# Altium schematic sheet 遥控启停.SchDoc
size A4; SheetNumber: 1; SheetTotal: 1
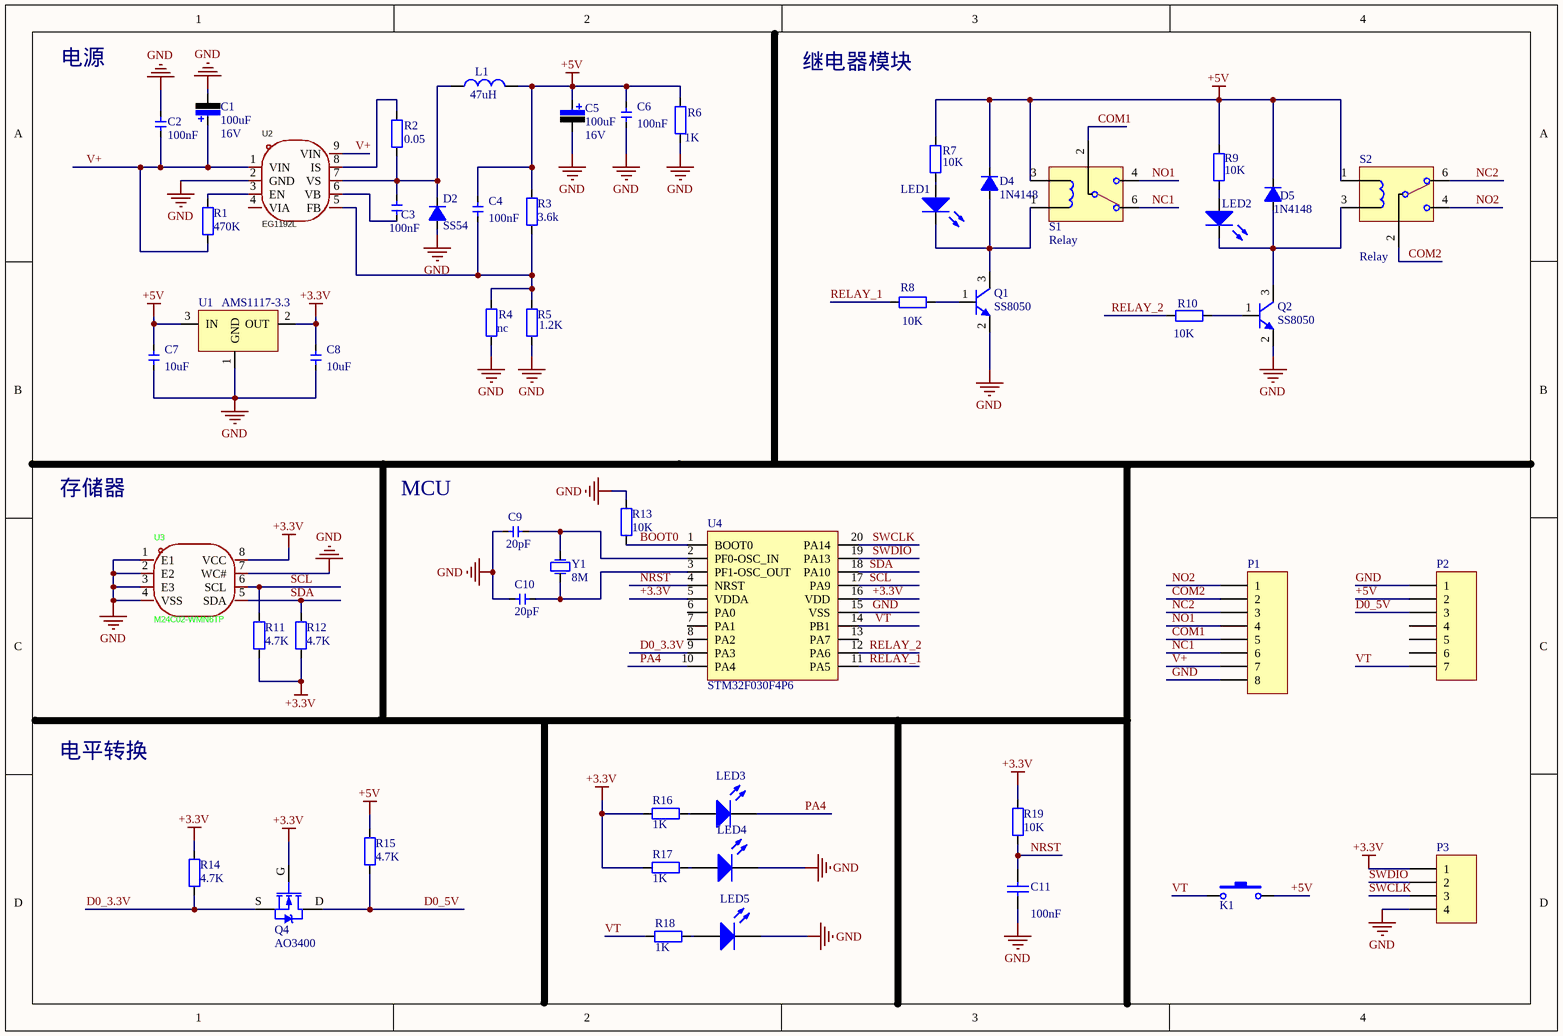
[diagram p0: 遥控启停.SchDoc]

## Parts
C1  value 100uF  Vol: 16V  [16V100uF]  (hidden comment: Cap Pol)
C2  100nF  [C0603]
C3  100nF  [C0603]
C4  100nF  [C0603]
C5  value 100uF  Vol: 16V  [16V100uF]  (hidden comment: Cap Pol)
C6  100nF  [C0603]
C7  10uF  [C0603]
C8  10uF  [C0603]
C9  20pF  [C0603]
C10  20pF  [C0603]
C11  value 100nF  [C0603]  (hidden comment: 0.1uF)
D2  SS54  [DIODE-SMA]
D4  1N4148  [DIODE-1206]
D5  1N4148  [DIODE-1206]
K1  SW-PB  [SW-SMD_4P-L6.0-W6.0]  (value not drawn)
L1  47uH  [IND-SMD_L4.5-W4.0]
LED1  LED  [LED0603-RD_RED]  (value not drawn)
LED2  LED  [LED0603-RD_RED]  (value not drawn)
LED3  LED0  [LED0603-RD_RED]  (value not drawn)
LED4  LED0  [LED0603-RD_RED]  (value not drawn)
LED5  LED0  [LED0603-RD_RED]  (value not drawn)
P1  Header 8  [XH2.54-W-8P]  (value not drawn)
P2  Header 7  [HDR1X7]  (value not drawn)
P3  Header 4  [HDR1X4]  (value not drawn)
Q1  SS8050  [SOT-23]
Q2  SS8050  [SOT-23]
Q4  AO3400  [SOT-23-MOSFET]
R1  470K  [R0603]
R2  0.05  [R0603]
R3  3.6k  [R0603]
R4  nc  [R0603]
R5  1.2K  [R0603]
R6  1K  [R0603]
R7  10K  [R0603]
R8  10K  [R0603]
R9  10K  [R0603]
R10  10K  [R0603]
R11  4.7K  [R0603]
R12  4.7K  [R0603]
R13  10K  [R0603]
R14  4.7K  [R0603]
R15  4.7K  [R0603]
R16  1K  [R0603]
R17  1K  [R0603]
R18  1K  [R0603]
R19  10K  [R0603]
S1  Relay  [SongLe_Relay]
S2  Relay  [SongLe_Relay]
U1  AMS1117-3.3  [SOT89]
U2  EG1192L  [ESOP-8_L4.9-W3.9-P1.27-LS6.0-BL-EP]
U3  M24C02-WMN6TP  [SOP-8]
U4  STM32F030F4P6  [TSSOP20]
Y1  value 8M  [X-SM49]  (hidden comment: Passive_Crystal_2Pin)

## Nets
+3.3V: C8.2 P3.1 Q4.G R11.2 R12.2 R14.2 R16.2 R17.2 R19.1 U1.2(OUT) U3.8(VCC) U4.5(VDDA) U4.16(VDD)
+5V: C4.2 C5.1 C6.2 C7.2 D4.2(K) D5.2(K) K1.2 L1.2 P2.2 R3.2 R6.2 R7.2 R9.2 R15.2 S1.3 S2.1 U1.3(IN)
GND: C1.2 C2.2 C5.2 C6.1 C7.1 C8.1 C9.2 C10.2 C11.1 D2.1(A) LED4.2(K) LED5.2(K) P1.8 P2.1 P3.4 Q1.2(E) Q2.2(E) R4.1 R5.1 R6.1 R13.2 U1.1(GND) U2.2(GND) U3.1(E1) U3.2(E2) U3.3(E3) U3.4(VSS) U3.7(WC#) U4.15(VSS)
BOOT0: R13.1 U4.1(BOOT0)
COM1: P1.5 S1.2
COM2: P1.2 S2.2
D0_3.3V: Q4.S R14.1 U4.9(PA3)
D0_5V: P2.3 Q4.D R15.1
NC1: P1.6 S1.6
NC2: P1.3 S2.6
NO1: P1.4 S1.4
NO2: P1.1 S2.4
NRST: C11.2 R19.2 U4.4(NRST)
PA4: LED3.2(K) U4.10(PA4)
RELAY_1: R8.2 U4.11(PA5)
RELAY_2: R10.2 U4.12(PA6)
SCL: R11.1 U3.6(SCL) U4.17(PA9)
SDA: R12.1 U3.5(SDA) U4.18(PA10)
SWCLK: P3.3 U4.20(PA14)
SWDIO: P3.2 U4.19(PA13)
V+: C1.1 C2.1 P1.7 R1.1 U2.1(VIN) U2.9(VIN)
VT: K1.1 P2.7 R18.2 U4.14(PB1)
NetC3_1: C3.1 U2.6(VB)
NetC3_2: C3.2 D2.2(K) L1.1 R2.2 U2.7(VS)
NetC4_1: C4.1 R3.1 R4.2 R5.2 U2.5(FB)
NetC9_1: C9.1 U4.2(PF0-OSC_IN) Y1.1
NetC10_1: C10.1 U4.3(PF1-OSC_OUT) Y1.2
NetD4_1: D4.1(A) LED1.2(K) Q1.3(C) S1.1
NetD5_1: D5.1(A) LED2.2(K) Q2.3(C) S2.3
NetLED1_1: LED1.1(A) R7.1
NetLED2_1: LED2.1(A) R9.1
NetLED3_1: LED3.1(A) R16.1
NetLED4_1: LED4.1(A) R17.1
NetLED5_1: LED5.1(A) R18.1
NetQ1_1: Q1.1(B) R8.1
NetQ2_1: Q2.1(B) R10.1
NetR1_2: R1.2 U2.3(EN)
NetR2_1: R2.1 U2.8(IS)

Not connected (* = marked no-connect by the designer): P2 4 5 6; U2 4(VIA); U4 6(PA0) 7(PA1) 8(PA2) 13(PA7)

## Notes on the sheet
- 电源
- 继电器模块
- 存储器
- MCU
- 电平转换

## Library data of the parts
C1 C5 = Cap Pol: 极性电解电容; Published: 8-Jun-2000; LatestRevisionDate: 17-Jul-2002; LatestRevisionNote: Re-released for DXP Platform.; PackageReference: RB7.6-15; Publisher: Altium Limited
C2-C4 C6-C10 = Cap: 无极性电容; Published: 8-Jun-2000; LatestRevisionDate: 17-Jul-2002; LatestRevisionNote: Re-released for DXP Platform.; PackageReference: RAD-0.3; Publisher: Altium Limited
C11 = Cap: Capacitor; Published: 8-Jun-2000; LatestRevisionDate: 17-Jul-2002; LatestRevisionNote: Re-released for DXP Platform.; PackageReference: RAD-0.3; Publisher: Altium Limited; PackageDescription: Radial Cap, Thru-Hole; 2 Leads; 0.3 in Pin Spacing
D2 D4 D5 = Diode: 二极管
K1 = SW-PB: 微动开关; Suppliter Part: C961737; Published: 24-Mar-1999; LatestRevisionDate: 17-Jul-2002; LatestRevisionNote: Re-released for DXP Platform.; PackageReference: SPST-2; Publisher: Altium Limited
L1 = Inductor: 电感; Code_IEC: 1005; Published: 8-Jun-2000; LatestRevisionDate: 17-Jul-2002; LatestRevisionNote: Re-released for DXP Platform.; PackageReference: 0402-A; Publisher: Altium Limited; Code_JEITA: 0402
LED1 LED2 = LED: 发光二极管; Published: 8-Jun-2000; LatestRevisionDate: 08-Jul-2005; LatestRevisionNote: Mech Layer 1 removed.; PackageReference: LED-0; Publisher: Altium Limited
LED3-LED5 = LED0: Typical INFRARED GaAs LED; Published: 8-Jun-2000; LatestRevisionDate: 08-Jul-2005; LatestRevisionNote: Mech Layer 1 removed.; PackageReference: LED-0; Publisher: Altium Limited; PackageDescription: LED; 2 Leads
P1 = Header 8: Header, 8-Pin; LatestRevisionDate: 17-Jul-2002; LatestRevisionNote: Re-released for DXP Platform.; Publisher: Altium Limited
P2 = Header 7: Header, 7-Pin; LatestRevisionDate: 17-Jul-2002; LatestRevisionNote: Re-released for DXP Platform.; Publisher: Altium Limited
P3 = Header 4: Header, 4-Pin; LatestRevisionDate: 17-Jul-2002; LatestRevisionNote: Re-released for DXP Platform.; Publisher: Altium Limited
Q1 Q2 = SS8050: NPN贴片三极管; Published: 8-Jun-2000; LatestRevisionDate: 15-Jan-2003; LatestRevisionNote: PCB Footprint 'BCY-W3/D4.7' replaced; DatasheetDocument: 1997; PackageDocument: Sep-1998; PackageReference: TO-92A; Publisher: Altium Limited; Code_JEDEC: TO-92A; ComponentLink1Description: Manufacturer Link; ComponentLink1URL: http://www.fairchildsemi.com/; ComponentLink2Description: Datasheet; ComponentLink2URL: http://www.fairchildsemi.com/ds/2N%2F2N3904.pdf
Q4 = MOSFET-N: N沟道MOS管
R1-R19 = Res: 贴片电阻; Published: 8-Jun-2000; LatestRevisionDate: 17-Jul-2002; LatestRevisionNote: Re-released for DXP Platform.; PackageReference: AXIAL-0.4; Publisher: Altium Limited
S1 S2 = Relay: 继电器
U1 = AMS1117: 3.3V稳压芯片
U2 = EG1192L: 10-100V高压电源管理芯片; Manufacturer: EG(屹晶微); Add into BOM: yes; Function: 降压型; Output Type: 可调; Input Voltage: 10V~100V; Output Current: 3A; Switching Frequency: 110kHz; Synchronous Rectification: 是; Number of Outputs: 1; Topology: 降压式; Quiescent Current (Iq): 2uA; Switch tube (built-in/external): 内置; Symbol: EG1192L; Device: EG1192L; LCSC Part Name: 零功耗使能降压DCDC电源芯片; Supplier Part: C2987436; Manufacturer Part: EG1192L; Supplier Footprint: ESOP-8; JLCPCB Part Class: Extended Part; Datasheet: https://atta.szlcsc.com/upload/public/pdf/source/20220401/C4C4A2A7D21C9FC2776ECF40A6ED664C.pdf; Supplier: LCSC; Convert to PCB: yes; Output Voltage: -; Operating Temperature: -45℃~+125℃
U3 = M24C02-WMN6TP: Manufacturer: ST(意法半导体); Add into BOM: yes; Interface Type: I2C; Memory Size: 2Kbit; Supply Voltage: 2.5V~5.5V; Write Cycle Time (Tw): 5ms; Data Retention - TDR (Year): 200年; Write Cycle Endurance: 1200000次; Symbol: M24C02-WMN6TP; Device: M24C02-WMN6TP; LCSC Part Name: M24C02-WMN6TP; Supplier Part: C7562; Manufacturer Part: M24C02-WMN6TP; Supplier Footprint: SOIC-8; JLCPCB Part Class: Extended Part; Datasheet: https://atta.szlcsc.com/upload/public/pdf/source/20140724/1457707167301.pdf; Supplier: LCSC; Convert to PCB: yes; Operating Temperature: -40℃~+85℃
U4 = STM32F030F4P6: STM32F030F4P6_CortexM0芯片
Y1 = Passive_Crystal_2Pin: 两脚无源晶振; Published: 8-Jun-2000; LatestRevisionDate: 17-Jul-2002; LatestRevisionNote: Re-released for DXP Platform.; PackageReference: R38; Publisher: Altium Limited